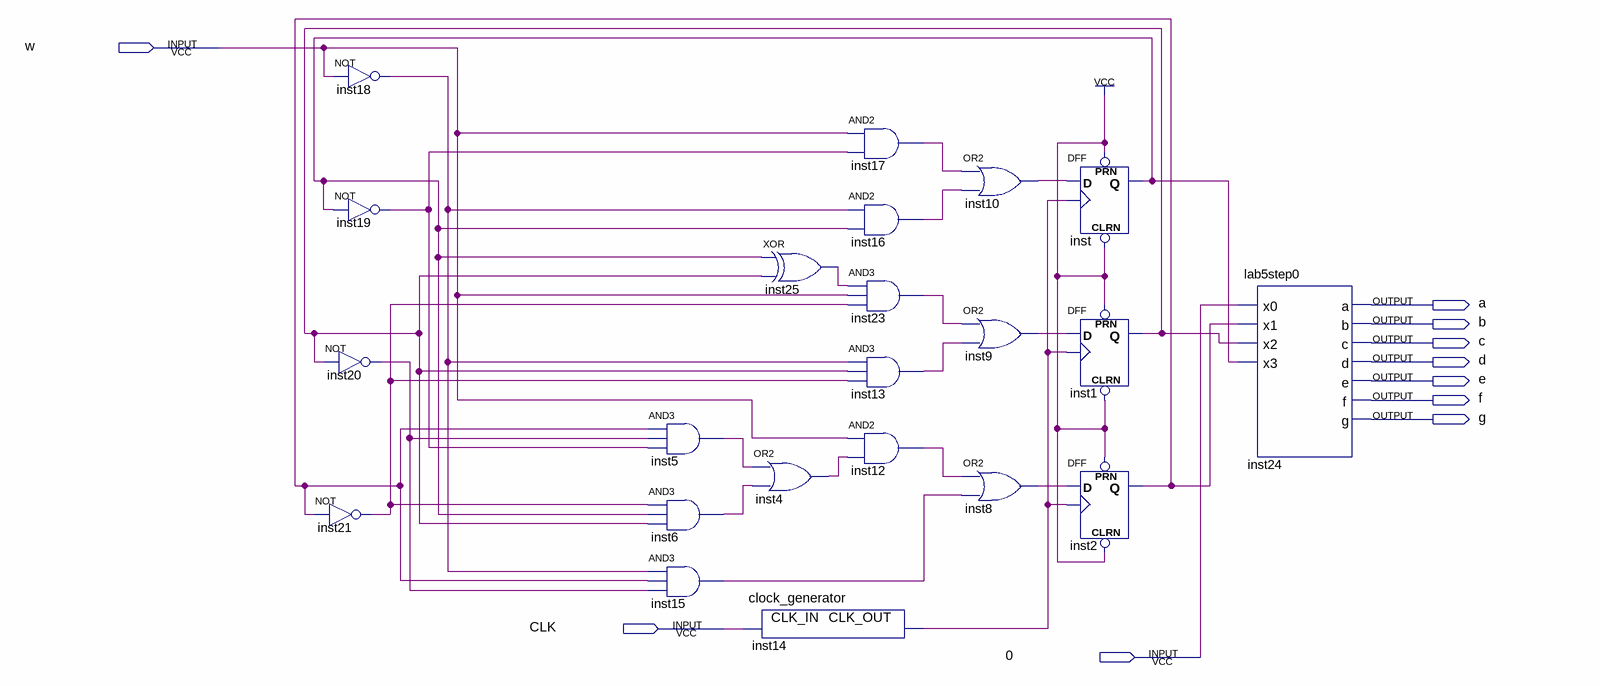
[diagram p0: schematic sheet]
// Quartus schematic lab11step1.bdf as structural Verilog: 22 symbols, 10 pins
module lab11step1 (
  input  w,
  input  CLK,
  input  \0 ,
  output a,
  output b,
  output c,
  output d,
  output e,
  output f,
  output g
);

  wire inst1_q, inst2_q, inst4_out, inst5_out, inst6_out, inst8_out, inst9_out, inst10_out, inst12_out,
       inst13_out, inst14_clk_out, inst15_out, inst16_out, inst17_out, inst18_out, inst19_out, inst20_out,
       inst21_out, inst23_out, inst25_out, inst_q;

  not inst21 (inst21_out, inst2_q);
  not inst18 (inst18_out, w);
  not inst19 (inst19_out, inst_q);
  not inst20 (inst20_out, inst1_q);
  and inst5 (inst5_out, inst2_q, inst20_out, inst19_out);
  and inst6 (inst6_out, inst21_out, inst_q, inst1_q);
  and inst15 (inst15_out, inst18_out, inst2_q, inst20_out);
  xor inst25 (inst25_out, inst_q, inst1_q);
  or inst4 (inst4_out, inst5_out, inst6_out);
  clock_generator inst14 (.CLK_IN(CLK), .CLK_OUT(inst14_clk_out));
  and inst17 (inst17_out, w, inst19_out);
  and inst16 (inst16_out, inst18_out, inst_q);
  and inst23 (inst23_out, inst25_out, w, inst21_out);
  and inst13 (inst13_out, inst18_out, inst1_q, inst21_out);
  and inst12 (inst12_out, w, inst4_out);
  or inst10 (inst10_out, inst17_out, inst16_out);
  or inst9 (inst9_out, inst23_out, inst13_out);
  or inst8 (inst8_out, inst12_out, inst15_out);
  DFF inst (.CLRN(1'b1), .CLK(inst14_clk_out), .D(inst10_out), .PRN(1'b1), .Q(inst_q));
  DFF inst1 (.CLRN(1'b1), .CLK(inst14_clk_out), .D(inst9_out), .PRN(1'b1), .Q(inst1_q));
  DFF inst2 (.CLRN(1'b1), .CLK(inst14_clk_out), .D(inst8_out), .PRN(1'b1), .Q(inst2_q));
  lab5step0 inst24 (.x0(\0 ), .x1(inst2_q), .x2(inst1_q), .x3(inst_q), .a(a), .b(b), .c(c), .d(d), .e(e), .f(f), .g(g));
endmodule
